# EAGLE design display2 (EAGLE 5.07)
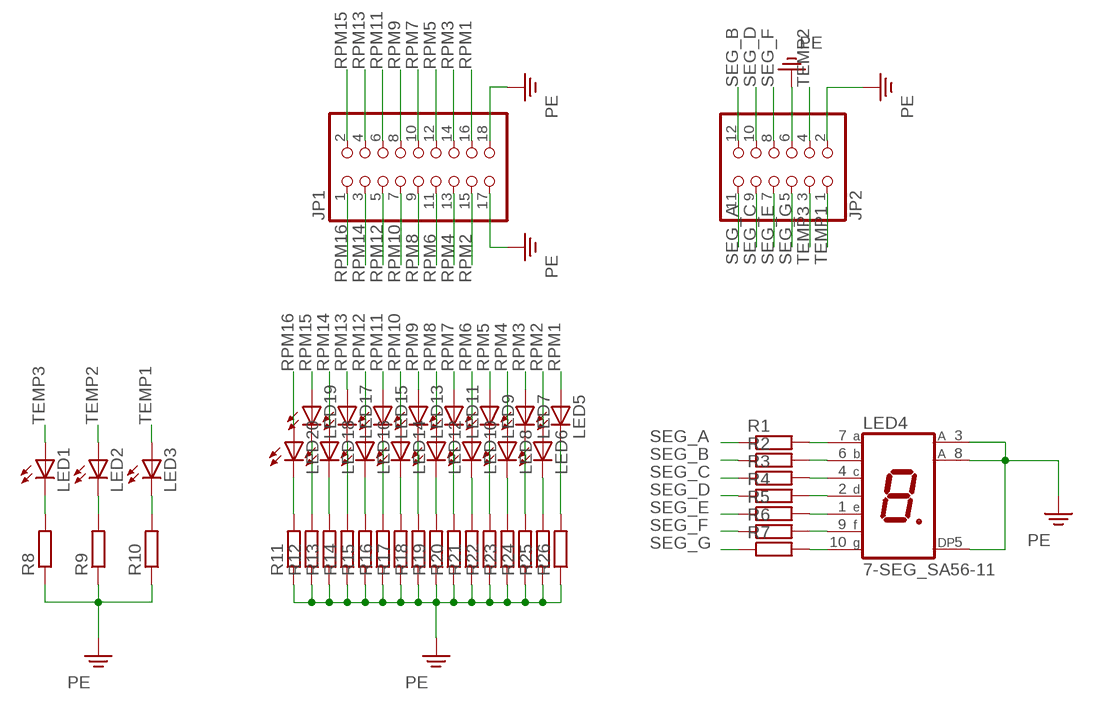
[diagram p0: schematic, sheet 1]

## Parts
JP1  PINHD-2X9  [2X09]
JP2  PINHD-2X6  [2X06]
LED1  LED3MM  [LED3MM]
LED2  LED3MM  [LED3MM]
LED3  LED3MM  [LED3MM]
LED4  7-SEG_SA56-11  [SA56-11]
LED5  LED3MM  [LED3MM]
LED6  LED3MM  [LED3MM]
LED7  LED3MM  [LED3MM]
LED8  LED3MM  [LED3MM]
LED9  LED3MM  [LED3MM]
LED10  LED3MM  [LED3MM]
LED11  LED3MM  [LED3MM]
LED12  LED3MM  [LED3MM]
LED13  LED3MM  [LED3MM]
LED14  LED3MM  [LED3MM]
LED15  LED3MM  [LED3MM]
LED16  LED3MM  [LED3MM]
LED17  LED3MM  [LED3MM]
LED18  LED3MM  [LED3MM]
LED19  LED3MM  [LED3MM]
LED20  LED3MM  [LED3MM]
R1  R-EU_M0805  [M0805]
R2  R-EU_M0805  [M0805]
R3  R-EU_M0805  [M0805]
R4  R-EU_M0805  [M0805]
R5  R-EU_M0805  [M0805]
R6  R-EU_M0805  [M0805]
R7  R-EU_M0805  [M0805]
R8  R-EU_M0805  [M0805]
R9  R-EU_M0805  [M0805]
R10  R-EU_M0805  [M0805]
R11  R-EU_M0805  [M0805]
R12  R-EU_M0805  [M0805]
R13  R-EU_M0805  [M0805]
R14  R-EU_M0805  [M0805]
R15  R-EU_M0805  [M0805]
R16  R-EU_M0805  [M0805]
R17  R-EU_M0805  [M0805]
R18  R-EU_M0805  [M0805]
R19  R-EU_M0805  [M0805]
R20  R-EU_M0805  [M0805]
R21  R-EU_M0805  [M0805]
R22  R-EU_M0805  [M0805]
R23  R-EU_M0805  [M0805]
R24  R-EU_M0805  [M0805]
R25  R-EU_M0805  [M0805]
R26  R-EU_M0805  [M0805]

## Nets
N$10: LED4.7(A) R1.2
N$11: LED4.6(B) R2.2
N$12: LED4.4(C) R3.2
N$13: LED4.2(D) R4.2
N$14: LED4.1(E) R5.2
N$15: LED4.9(F) R6.2
N$16: LED4.10(G) R7.2
N$17: LED1.K(C) R8.2
N$18: LED2.K(C) R9.2
N$19: LED3.K(C) R10.2
N$21: LED14.K(C) R17.2
N$22: LED13.K(C) R18.2
N$23: LED12.K(C) R19.2
N$24: LED11.K(C) R20.2
N$25: LED10.K(C) R21.2
N$26: LED9.K(C) R22.2
N$27: LED8.K(C) R23.2
N$28: LED7.K(C) R24.2
N$29: LED6.K(C) R25.2
N$30: LED5.K(C) R26.2
N$37: LED20.K(C) R11.2
N$38: LED19.K(C) R12.2
N$39: LED18.K(C) R13.2
N$40: LED17.K(C) R14.2
N$41: LED16.K(C) R15.2
N$42: LED15.K(C) R16.2
PE: JP1.17 JP1.18 JP2.2 JP2.6 LED4.3(A) LED4.5(DP) LED4.8(A) R8.1 R9.1 R10.1 R11.1 R12.1 R13.1 R14.1 R15.1 R16.1 R17.1 R18.1 R19.1 R20.1 R21.1 R22.1 R23.1 R24.1 R25.1 R26.1
RPM1: JP1.16 LED5.A
RPM2: JP1.15 LED6.A
RPM3: JP1.14 LED7.A
RPM4: JP1.13 LED8.A
RPM5: JP1.12 LED9.A
RPM6: JP1.11 LED10.A
RPM7: JP1.10 LED11.A
RPM8: JP1.9 LED12.A
RPM9: JP1.8 LED13.A
RPM10: JP1.7 LED14.A
RPM11: JP1.6 LED15.A
RPM12: JP1.5 LED16.A
RPM13: JP1.4 LED17.A
RPM14: JP1.3 LED18.A
RPM15: JP1.2 LED19.A
RPM16: JP1.1 LED20.A
SEG_A: JP2.11 R1.1
SEG_B: JP2.12 R2.1
SEG_C: JP2.9 R3.1
SEG_D: JP2.10 R4.1
SEG_E: JP2.7 R5.1
SEG_F: JP2.8 R6.1
SEG_G: JP2.5 R7.1
TEMP1: JP2.1 LED3.A
TEMP2: JP2.4 LED2.A
TEMP3: JP2.3 LED1.A

## Library data of the parts
JP1 = pinhead:PINHD-2X9: PIN HEADER
JP2 = pinhead:PINHD-2X6: PIN HEADER
LED1-LED3 LED5-LED20 = led:LED: LED OSRAM: - CHIPLED LG R971, LG N971, LY N971, LG Q971, LY Q971, LO R971, LY R971 LH N974, LH R974 LS Q976, LO Q976, LY Q976 LO Q996 - Hyper CHIPLED LW Q18S LB Q993, LB Q99A, LB R99A - SideLED LS A670, LO A670, LY A670, LG A670, LP A670 LB A673, LV A673, LT A673, LW A673 LH A674 LY A675 LS A676, LA A676, LO A676, LY A676, LW A676 LS A679, LY A679, LG A679 - Hyper Micro SIDELED® LS Y876, LA Y876, LO Y876, LY Y876 LT Y87S - SmartLED LW L88C, LW L88S LB L89C, LB L89S, LG L890 LS L89K, LO L89K, LY L89K LS L896, LA L896, LO L896, LY L896 - TOPLED LS T670, LO T670, LY T670, LG T670, LP T670 LSG T670, LSP T670, LSY T670, LOP T670, LYG T670 LG T671, LOG T671, LSG T671 LB T673, LV T673, LT T673, LW T673 LH T674 LS T676, LA T676, LO T676, LY T676, LB T676, LH T676, LSB T676, LW T676 LB T67C, LV T67C, LT T67C, LS T67K, LO T67K, LY T67K, LW E67C LS E67B, LA E67B, LO E67B, LY E67B, LB E67C, LV E67C, LT E67C LW T67C LS T679, LY T679, LG T679 LS T770, LO T770, LY T770, LG T770, LP T770 LB T773, LV T773, LT T773, LW T773 LH T774 LS E675, LA E675, LY E675, LS T675 LS T776, LA T776, LO T776, LY T776, LB T776 LHGB T686 LT T68C, LB T68C - Hyper Mini TOPLED® LB M676 - Mini TOPLED Santana® LG M470 LS M47K, LO M47K, LY M47K Source: http://www.osram.convergy.de LUXEON: - LUMILED® LXK2-PW12-R00, LXK2-PW12-S00, LXK2-PW14-U00, LXK2-PW14-V00 LXK2-PM12-R00, LXK2-PM12-S00, LXK2-PM14-U00 LXK2-PE12-Q00, LXK2-PE12-R00, LXK2-PE12-S00, LXK2-PE14-T00, LXK2-PE14-U00 LXK2-PB12-K00, LXK2-PB12-L00, LXK2-PB12-M00, LXK2-PB14-N00, LXK2-PB14-P00, LXK2-PB14-Q00 LXK2-PR12-L00, LXK2-PR12-M00, LXK2-PR14-Q00, LXK2-PR14-R00 LXK2-PD12-Q00, LXK2-PD12-R00, LXK2-PD12-S00 LXK2-PH12-R00, LXK2-PH12-S00 LXK2-PL12-P00, LXK2-PL12-Q00, LXK2-PL12-R00 Source: www.luxeon.com KINGBRIGHT: KA-3528ASYC Source: www.kingbright.com
LED4 = display-kingbright:7-SEG_: Kingbright 14.2mm (0.56 INCH) SINGLE DIGIT NUMERIC DUISPLAY Source: SA56-11EWA(Ver1189471036.pdf
R1-R26 = resistor:R-EU_: RESISTOR, European symbol

## Board
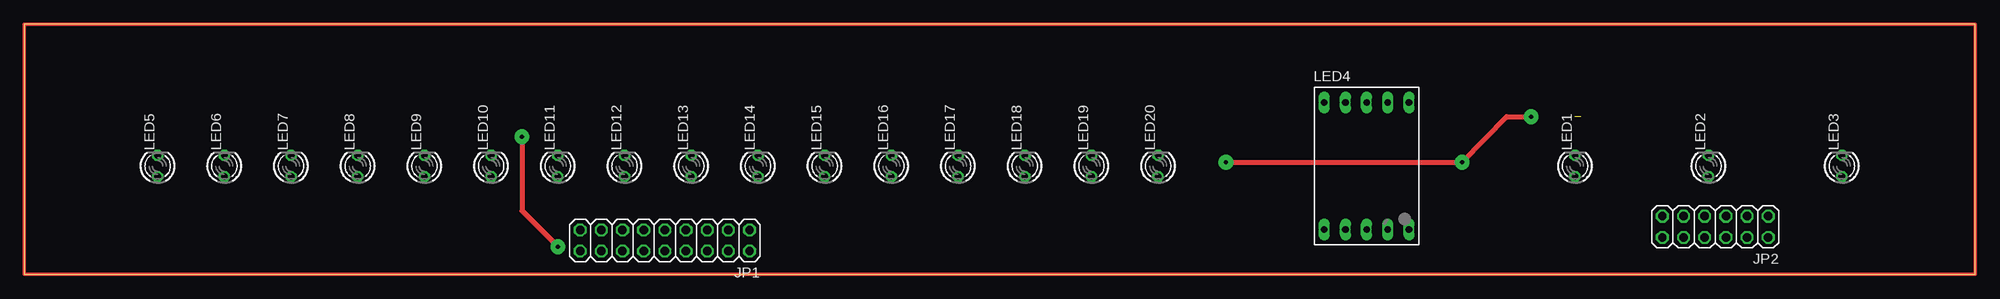
[diagram p1: board, top side]
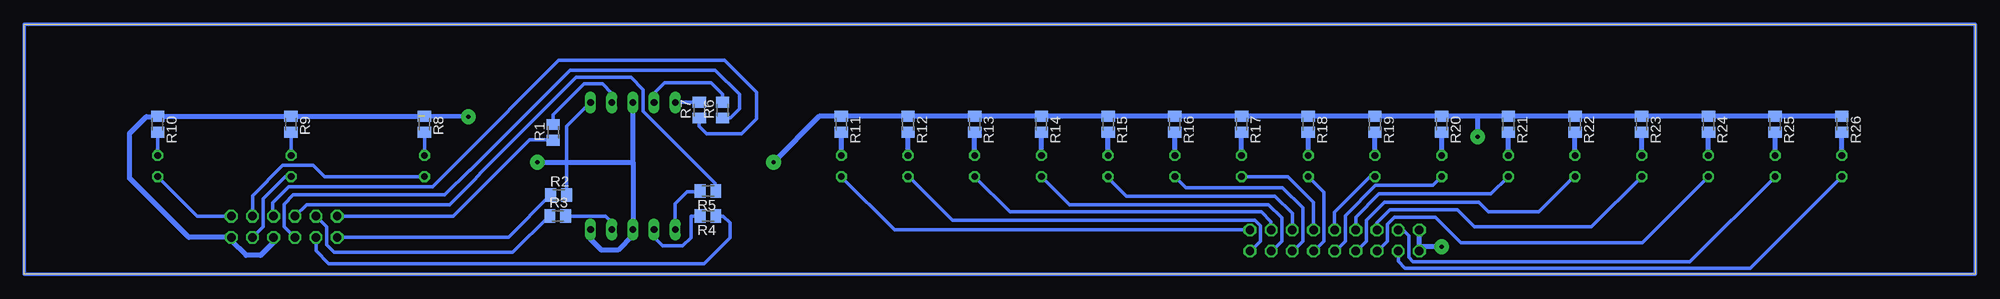
[diagram p2: board, bottom side, seen from below]

Size 234 x 30 mm. Coordinates in mm from the lower left corner, seen from the top.
Outline: 0,0 234,0 234,30 0,30 0,0
Copper layers (1*16): Top 0.035mm / dielectric 1.5mm / Bottom 0.035mm
Design rules "default": minimum track width 10mil, minimum drill 24mil, track to track 8mil, track to pad 8mil, pad to pad 8mil, via to via 8mil, smd to smd 8mil, copper to edge 40mil, drill to drill 8mil, minimum pad ring 10mil, minimum via ring 8mil, stop-mask expansion 4mil, vias tented up to drill 0mil, thermal gap 10mil

### Footprints (pad centres in the part's own frame; a part is rotated, then mirrored left to right if it is on the bottom)
2X09 = drill 1.016 octagon: 1 -10.16,-1.27; 2 -10.16,1.27; 3 -7.62,-1.27; 4 -7.62,1.27; 5 -5.08,-1.27; 6 -5.08,1.27; 7 -2.54,-1.27; 8 -2.54,1.27; 9 0,-1.27; 10 0,1.27; 11 2.54,-1.27; 12 2.54,1.27; 13 5.08,-1.27; 14 5.08,1.27; 15 7.62,-1.27; 16 7.62,1.27; 17 10.16,-1.27; 18 10.16,1.27
2X06 = drill 1.016 octagon: 1 -6.35,-1.27; 2 -6.35,1.27; 3 -3.81,-1.27; 4 -3.81,1.27; 5 -1.27,-1.27; 6 -1.27,1.27; 7 1.27,-1.27; 8 1.27,1.27; 9 3.81,-1.27; 10 3.81,1.27; 11 6.35,-1.27; 12 6.35,1.27
LED3MM = drill 0.813 octagon: A -1.27,0; K 1.27,0
SA56-11 = drill 0.8 long: 1 -5.08,-7.62; 2 -2.54,-7.62; 3 0,-7.62; 4 2.54,-7.62; 5 5.08,-7.62; 6 5.08,7.62; 7 2.54,7.62; 8 0,7.62; 9 -2.54,7.62; 10 -5.08,7.62
M0805 = smd 1.3 x 1.6: 1 -0.95,0; 2 0.95,0

### Placement (x,y rotation side)
JP1  76.83,4.06 180 top
JP2  202.82,5.71 180 top
LED1  186,13 90 top
LED2  202,13 90 top
LED3  218,13 90 top
LED4  161,13.01 0 top
LED5  16,13 90 top
LED6  24,13 90 top
LED7  32,13 90 top
LED8  40,13 90 top
LED9  48,13 90 top
LED10  56,13 90 top
LED11  64,13 90 top
LED12  72,13 90 top
LED13  80,13 90 top
LED14  88,13 90 top
LED15  96,13 90 top
LED16  104,13 90 top
LED17  112,13 90 top
LED18  120,13 90 top
LED19  128,13 90 top
LED20  136,13 90 top
R1  170.56,17.04 90 bottom
R2  169.91,9.53 0 bottom
R3  170,7 0 bottom
R4  152,7 180 bottom
R5  152,10 180 bottom
R6  150.24,19.7 90 bottom
R7  153.03,19.7 90 bottom
R8  186,18 270 bottom
R9  202,18 270 bottom
R10  218,18 270 bottom
R11  136,18 270 bottom
R12  128,18 270 bottom
R13  120,18 270 bottom
R14  112,18 270 bottom
R15  104,18 270 bottom
R16  96,18 270 bottom
R17  88,18 270 bottom
R18  80,18 270 bottom
R19  72,18 270 bottom
R20  64,18 270 bottom
R21  56,18 270 bottom
R22  48,18 270 bottom
R23  40,18 270 bottom
R24  32,18 270 bottom
R25  24,18 270 bottom
R26  16,18 270 bottom

### Tracks (layer width: path | path; a pad name or v marks a point on that pad's centre or on a via)
N$1
  Bottom 0.406: 0,0 0,30 234,30 234,0 0,0
N$2
  Top 0.406: 0,0 0,30 234,30 234,0 0,0
N$10
  Bottom 0.406: R1.2 170.56,19.18 166.88,22.86 164.66,22.86 163.54,21.74 LED4.7
N$11
  Bottom 0.406: LED4.6 168.96,17.75 R2.2
N$12
  Bottom 0.406: LED4.4 163.54,6.29 164.25,7 R3.2
N$13
  Bottom 0.406: R4.2 154.05,7 154.05,4.4 155.02,3.43 157.41,3.43 158.46,4.48 LED4.2
N$14
  Bottom 0.406: LED4.1 155.96,5.38 155.96,8.47 154.52,9.91 152.95,9.91 R5.2
N$15
  Bottom 0.406: LED4.9 158.5,20.62 158.5,21.66 157.17,22.99 151.62,22.99 150.24,21.61 R6.2
N$16
  Bottom 0.406: LED4.10 153.03,20.62 R7.2
N$17
  Bottom 0.406: LED1.K R8.2
N$18
  Bottom 0.406: LED2.K R9.2
N$19
  Bottom 0.406: LED3.K R10.2
N$21
  Bottom 0.61: LED14.K R17.2
N$22
  Bottom 0.61: LED13.K R18.2
N$23
  Bottom 0.61: LED12.K R19.2
N$24
  Bottom 0.61: LED11.K R20.2
N$25
  Bottom 0.61: LED10.K R21.2
N$26
  Bottom 0.61: LED9.K R22.2
N$27
  Bottom 0.61: LED8.K R23.2
N$28
  Bottom 0.61: LED7.K R24.2
N$29
  Bottom 0.61: LED6.K R25.2
N$30
  Bottom 0.61: LED5.K R26.2
N$37
  Bottom 0.61: LED20.K R11.2
N$38
  Bottom 0.61: LED19.K R12.2
N$39
  Bottom 0.61: LED18.K R13.2
N$40
  Bottom 0.61: LED17.K R14.2
N$41
  Bottom 0.61: LED16.K R15.2
N$42
  Bottom 0.61: LED15.K R16.2
PE  (via drill 0.5 pad 1.78)  (1 unrouted)
  Top 0.61: v180.72,18.92 177.8,18.92 v172.47,13.46 v144.15,13.46 | v59.69,16.51 59.69,7.62 v64.01,3.3
  Bottom 0.61: 186.69,19.05 186.69,18.95 R9.1 R10.1 218,18.92 219.35,18.92 221.36,16.91 221.36,11.53 214.27,4.45 JP2.2 209.17,4.05 207.41,2.29 205.66,2.29 204.09,3.86 JP2.6 | 161,13.46 LED4.8 | LED4.5 166.08,4.24 164.76,2.92 162.8,2.92 161.04,4.68 161.04,5.38 LED4.3 161,13.46 | R8.1 185.93,18.95 v180.72,18.92 | v172.47,13.46 161,13.46 | R26.1 R25.1 R24.1 R23.1 R22.1 R21.1 59.69,18.95 | 59.69,18.95 R20.1 R19.1 R18.1 R17.1 R16.1 R15.1 R14.1 R13.1 R12.1 R11.1 138.66,18.95 v144.15,13.46 | JP1.17 JP1.18 66.67,3.3 v64.01,3.3 | 59.69,18.95 v59.69,16.51
RPM1
  Bottom 0.406: LED5.A 26.97,0.76 68.4,0.76 69.22,1.57 JP1.16
RPM2
  Bottom 0.406: LED6.A 34.21,1.52 67.42,1.52 67.94,2.05 67.94,4.65 68.63,5.33 JP1.15
RPM3
  Bottom 0.406: LED7.A 39.92,3.81 61.72,3.81 64.77,6.86 69.67,6.86 70.48,6.04 70.48,3.99 71.68,2.79 JP1.14
RPM4
  Bottom 0.406: LED8.A 46.02,5.71 60.07,5.71 62.1,7.75 70.22,7.75 71.75,6.21 JP1.13
RPM5
  Bottom 0.406: LED9.A 48.13,11.73 52.37,7.49 58.42,7.49 59.56,8.64 70.87,8.64 73.03,6.48 73.03,3.99 74.22,2.79 JP1.12
RPM6
  Bottom 0.406: LED10.A 58.09,9.65 71.51,9.65 74.3,6.87 JP1.11
RPM7
  Bottom 0.406: LED11.A 65.07,10.67 71.93,10.67 75.56,7.03 75.56,3.99 76.76,2.79 JP1.10
RPM8
  Bottom 0.406: LED12.A 72.58,11.73 76.83,7.47 JP1.9
RPM9
  Bottom 0.406: LED13.A 78.11,9.84 78.11,3.99 79.3,2.79 JP1.8
RPM10
  Bottom 0.406: LED14.A 82.46,11.73 79.38,8.64 JP1.7
RPM11
  Bottom 0.406: LED15.A 96.01,11.73 94.7,10.41 83.07,10.41 80.64,7.99 80.64,3.99 81.84,2.79 JP1.6
RPM12
  Bottom 0.406: LED16.A 104.14,11.73 101.81,9.4 83.98,9.4 81.92,7.33 JP1.5
RPM13
  Bottom 0.406: LED17.A 112.01,11.73 108.67,8.38 84.76,8.38 83.19,6.81 83.19,3.99 84.38,2.79 JP1.4
RPM14
  Bottom 0.406: LED18.A 120.02,11.73 115.78,7.49 85.63,7.49 84.45,6.32 JP1.3
RPM15
  Bottom 0.406: LED19.A 127.89,11.73 122.64,6.48 86.37,6.48 85.72,5.83 85.72,3.99 86.92,2.79 JP1.2
RPM16
  Bottom 0.406: LED20.A 136.02,11.73 129.62,5.33 JP1.1
SEG_A
  Bottom 0.406: JP2.11 182.58,6.99 179.71,9.86 178.18,11.35 173.4,16.13 170.56,16.13 R1.1
SEG_B
  Bottom 0.406: R2.1 175.9,4.49 175.9,4.45 JP2.12
SEG_C
  Bottom 0.406: R3.1 171.07,7 175.4,2.67 196.84,2.67 197.74,3.56 197.74,5.71 JP2.9
SEG_D
  Bottom 0.406: JP2.10 199.01,2.82 197.46,1.27 152.45,1.27 149.35,4.37 149.35,6.17 150.16,6.99 151.05,6.99 R4.1
SEG_E
  Bottom 0.406: R5.1 151.13,10 151.13,10.94 159.77,19.57 159.77,22.17 161.21,23.62 167.8,23.62 179.2,12.23 179.96,11.38 182.96,8.38 200.15,8.38 JP2.7
SEG_F
  Bottom 0.406: JP2.8 202.82,5.71 202.82,8.43 201.73,9.53 183.57,9.53 180.59,12.5 180.54,12.5 168.53,24.51 151.13,24.51 148.21,21.59 148.21,19.89 149.3,18.8 150.2,18.8 R6.1
SEG_G
  Bottom 0.406: JP2.5 204.22,6.99 204.22,8.6 202.28,10.54 185.01,10.54 181.86,13.69 181.86,13.72 169.93,25.65 149.99,25.65 146.18,21.84 146.18,18.67 147.96,16.89 152.15,16.89 153.03,17.78 R7.1
TEMP1
  Bottom 0.406: JP2.1 213.25,6.99 LED3.A
TEMP2
  Bottom 0.406: LED2.A 202.69,11.73 205.36,9.06 205.36,5.71 JP2.4
TEMP3
  Bottom 0.406: LED1.A 197.99,11.73 199.34,13.08 203,13.08 206.63,9.45 JP2.3